# Altium project Overdrive.PrjPcb
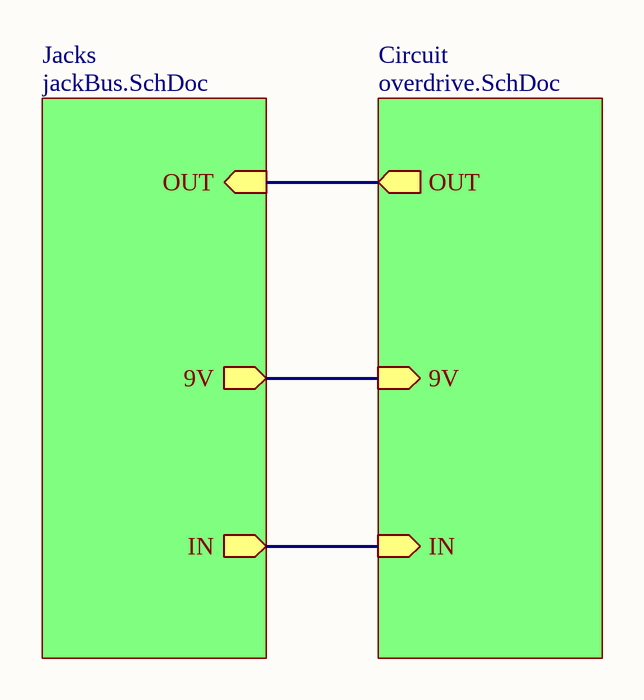
[diagram p0: pedal.SchDoc]
3 sheets, 22 parts. Net scope: hierarchical (ports join the sheet entries above them; power ports are global).
Board file: pedal.PcbDoc
Sheets:
  pedal.SchDoc
    Jacks = jackBus.SchDoc
    Circuit = overdrive.SchDoc

## Sheet pedal.SchDoc
size A4

### Sub-sheets
Circuit = overdrive.SchDoc: OUT (out), 9V (in), IN (in)
Jacks = jackBus.SchDoc: OUT (in), 9V (out), IN (out)

### Nets
NetCIN_1: sheet Jacks/IN, sheet Circuit/IN
NetJOUT_1: sheet Jacks/OUT, sheet Circuit/OUT
NetJSUP_1: sheet Jacks/9V, sheet Circuit/9V

## Sheet jackBus.SchDoc
size A4
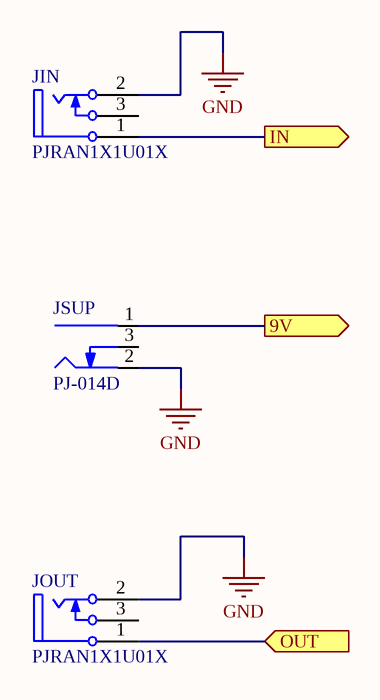
[diagram p1: jackBus.SchDoc]

### Parts
JIN  PJRAN1X1U01X  [SWIT-PJRAN1X1U01X_V]
JOUT  PJRAN1X1U01X  [SWIT-PJRAN1X1U01X_V]
JSUP  PJ-014D  [CUI PJ-014D]

### Ports
9V (out), IN (out), OUT (in)

### Nets
GND: JIN.2(TIP) JOUT.2(TIP) JSUP.2(Outer)
NetCIN_1: JIN.1(SLEEVE) ; port IN
NetJOUT_1: JOUT.1(SLEEVE) ; port OUT
NetJSUP_1: JSUP.1(Centre) ; port 9V

Not connected (* = marked no-connect by the designer): JIN 3(SHUNT); JOUT 3(SHUNT); JSUP 3(SW)

### Library data of the parts
JIN JOUT = CMP-1772-00003-1: Female Phono Jack, 3 Position, Height 13 mm, Tail Length 4 mm, RoHS, Bulk; Case\Package: Radial; Type (Capacitors): X7R; Tolerance: 10%; Voltage Rating (DC): 50 V; Capacitance: 100 nF; Package Quantity: 500; Mount: Through Hole; Packaging: Bulk; Height: 3.18 mm; Min Operating Temperature: -55 degC; Radiation Hardening: No; PackageDescription: Female Phono Jack, 3 Position, Height 13 mm, Tail Length 4 mm; Length: 6.6 mm; Lead Pitch: 2.54 mm; Width: 5.08 mm; REACH SVHC: No SVHC; ComponentLink1Description: Manufacturer URL; Max Operating Temperature: 125 degC; ComponentLink2Description: Datasheet; DatasheetVersion: Rev. A, 01/2006; Voltage Rating: 50 V; ComponentLink2URL: http://www.conxall.com/Drawings/pjran1x1u__x_series_cd.pdf; ComponentLink1URL: http://www.switchcraft.com/; RoHSCompliant: true; Pins: 2; PackageReference: PJRAN1X1U01X
JSUP = PJ-014D: CONN PWR JACK 1.3X3.4MM SOLDER; Manufacturer: CUI Devices; Actual Diameter: 0.051" (1.30mm ID), 0.165" (4.20mm OD); Current Rating (Amps): 2.5A; Gender: Male; Industry Recognized Mating Diameter: 1.30mm ID (0.051"), 3.40mm OD (0.134"); Internal Switch(s): Single Switch, Normally Closed; Material Flammability Rating: UL94 V-0; Mating Length/Depth: 0.283" (7.20mm); Number of Positions/Contacts: 2 Conductors, 3 Contacts; Shielding: Unshielded; Voltage - Rated: 24VDC; Part Number: PJ-014D; ComponentLink1Description: Datasheet; ComponentLink1URL: https://www.cuidevices.com/product/resource/digikeypdf/pj-014d.pdf; ComponentLink2Description: DigiKey Link; ComponentLink2URL: //digikey.com/product-detail/en/cui-devices/PJ-014D/CP-014D-ND/372124; Connector Type: Jack; Features: Board Guide; LastUpdated: 16/12/2019 18:55:00; Lifecycle Status: 0; Minimum Order: 1; Mounting Type: Through Hole, Right Angle; Packaging: Bulk; Part Status: Active; Price: 0.65; Series: -; Supplier 1: DigiKey; Supplier Part Number 1: CP-014D-ND; Termination: Solder

## Sheet overdrive.SchDoc
size A4
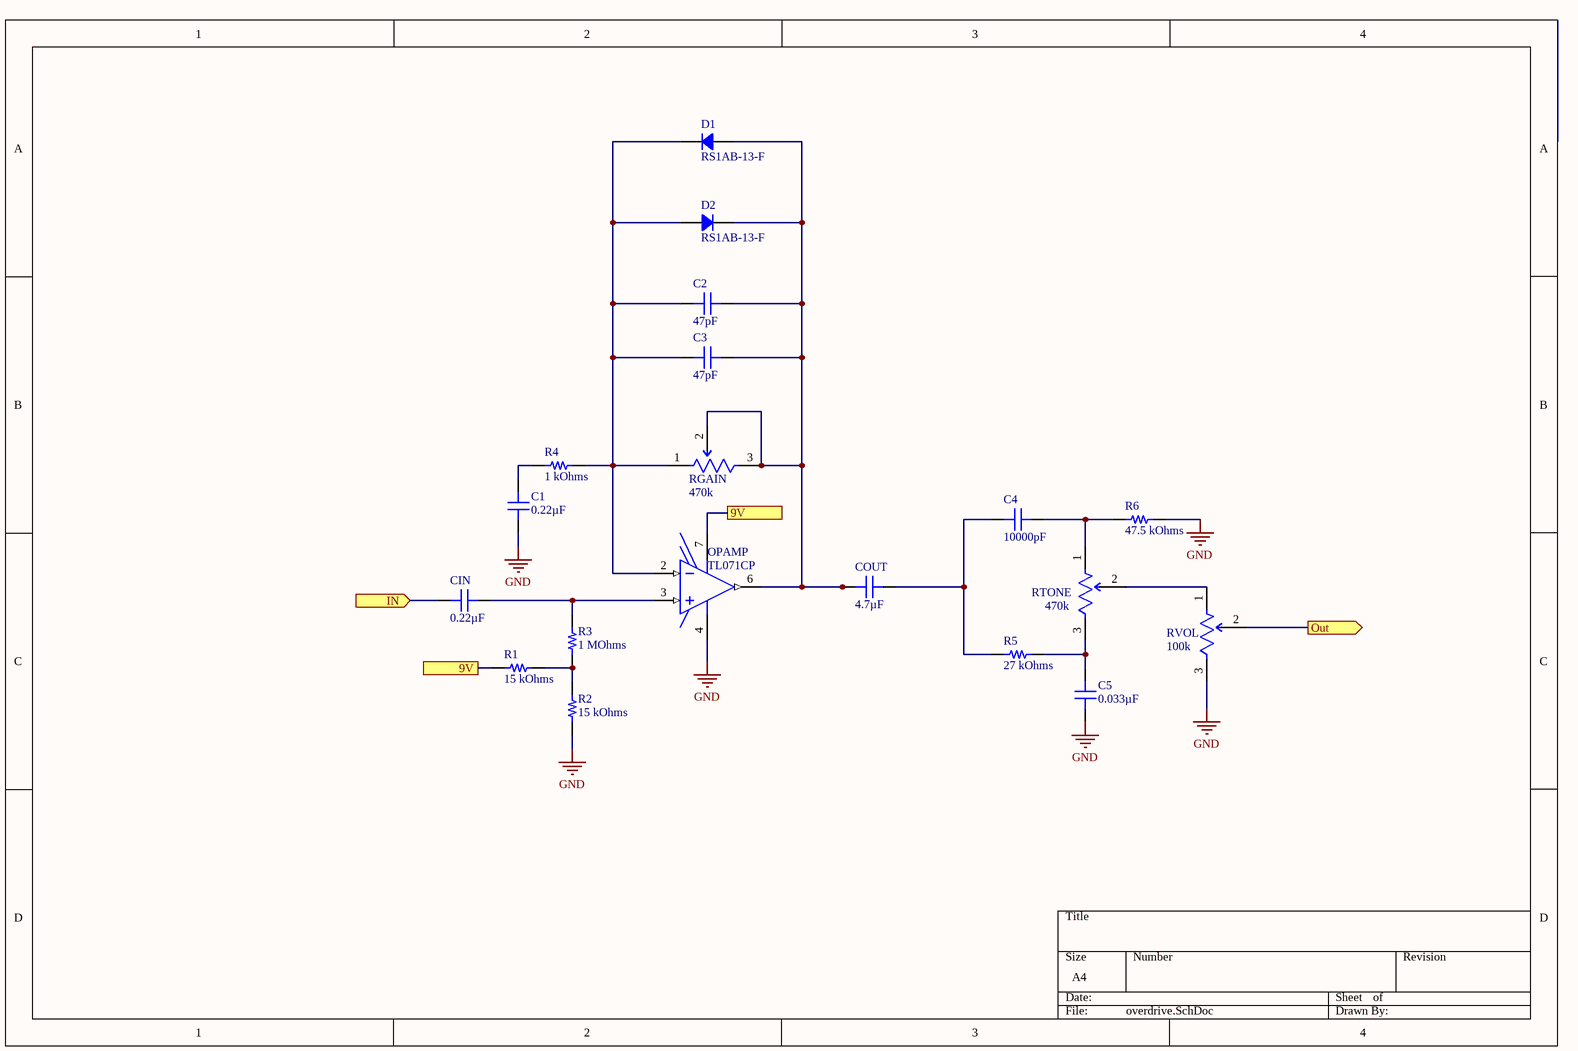
[diagram p2: overdrive.SchDoc]

### Parts
C1  0.22µF  [CAP 0402_1005]
C2  47pF  [CAP 01005_0402]
C3  47pF  [CAP 01005_0402]
C4  10000pF  [CAP 0402_1005]
C5  0.033µF  [CAP 0402_1005]
CIN  0.22µF  [CAP 0402_1005]
COUT  4.7µF  [CAP 0402_1005]
D1  RS1AB-13-F  [DO214AA SMB]
D2  RS1AB-13-F  [DO214AA SMB]
OPAMP  TL071CP  [P0008A]
R1  15 kOhms  [RES 0201_0603]
R2  15 kOhms  [RES 0201_0603]
R3  1 MOhms  [RES 0201_0603]
R4  1 kOhms  [RES 0201_0603]
R5  27 kOhms  [RES 0201_0603]
R6  47.5 kOhms  [RES 0201_0603]
RGAIN  470k  [FP-3310R-MFG]
RTONE  470k  [FP-3310R-MFG]
RVOL  100k  [FP-3310R-MFG]

### Ports
9V, IN (in), Out (out)

### Nets
GND: C1.2 C5.1 OPAMP.4(VCC-) R2.1 R6.2 RVOL.3(CW)
NetC1_1: C1.1 R4.1
NetC2_1: C2.1 C3.1 D1.2 D2.1 OPAMP.2(IN-) R4.2 RGAIN.1(CCW)
NetC2_2: C2.2 C3.2 COUT.1 D1.1 D2.2 OPAMP.6(OUT) RGAIN.2 RGAIN.3(CW)
NetC4_1: C4.1 R6.1 RTONE.1(CCW)
NetC4_2: C4.2 COUT.2 R5.1
NetC5_2: C5.2 R5.2 RTONE.3(CW)
NetCIN_1: CIN.1 ; port IN
NetCIN_2: CIN.2 OPAMP.3(IN+) R3.1
NetJOUT_1: RVOL.2 ; port Out
NetJSUP_1: OPAMP.7(VCC+) R1.1 ; port 9V
NetR1_2: R1.2 R2.2 R3.2
NetRTONE_2: RTONE.2 RVOL.1(CCW)

Not connected (* = marked no-connect by the designer): OPAMP 1(OFFSET_N1) 5(OFFSET_N2) 8(NC)

### Library data of the parts
C1 CIN = 0402BW224K160YT: CAP CER 0.22UF 16V X5R 0402; Manufacturer: Knowles Novacap; Tolerance: ±10%; Part Number: 0402BW224K160YT; Value: 0.22µF; Applications: General Purpose; Capacitance: 0.22µF; ComponentLink1Description: Datasheet; ComponentLink1URL: https://www.knowlescapacitors.com/getattachment/6c8d48ef-fc2b-4752-ae2c-ce6c208de0c4/High-Capacitance-Chip.aspx; ComponentLink2Description: DigiKey Link; ComponentLink2URL: http://digikey.com/product-detail/en/knowles-novacap/0402BW224K160YT/1763-1189-1-ND/7304304; Device Package: 0402 (1005 Metric); LastUpdated: 02/09/2020 01:02:25; Lifecycle Status: Active; Minimum Order: 1; Mounting Type: Surface Mount, MLCC; Operating Temperature: -55°C ~ 85°C; Package / Case: 0402 (1005 Metric); Packaging: TapeAndReel; PartId: 1712; Part Status: Active; Price: 0.47; Series: -; Size / Dimension: 0.040" L x 0.020" W (1.02mm x 0.51mm); Supplier 1: DigiKey; Supplier Part Number 1: 1763-1189-1-ND; Temperature Coefficient: X5R; Thickness (Max): 0.024" (0.61mm); Voltage - Rated: 16V
C2 C3 = GRM0225C1E470GA02L: CAP CER 47PF 25V C0G/NP0 01005; Manufacturer: Murata Electronics; Temperature Coefficient: C0G, NP0; Tolerance: ±2%; Part Number: GRM0225C1E470GA02L; Value: 47pF; Applications: General Purpose; Capacitance: 47pF; ComponentLink1Description: Datasheet; ComponentLink1URL: https://search.murata.co.jp/Ceramy/image/img/A01X/G101/ENG/GRM0225C1E470GA02-01.pdf; ComponentLink2Description: DigiKey Link; ComponentLink2URL: http://digikey.com/product-detail/en/murata-electronics/GRM0225C1E470GA02L/490-10133-1-ND/5026000; Device Package: 01005 (0402 Metric); LastUpdated: 02/09/2020 01:27:43; Lifecycle Status: Active; Minimum Order: 1; Mounting Type: Surface Mount, MLCC; Operating Temperature: -55°C ~ 125°C; Package / Case: 01005 (0402 Metric); Packaging: TapeAndReel; Part Status: Active; Price: 0.01; Series: GRM; Size / Dimension: 0.016" L x 0.008" W (0.40mm x 0.20mm); Supplier 1: DigiKey; Supplier Part Number 1: 490-10133-1-ND; Thickness (Max): 0.009" (0.22mm); Voltage - Rated: 25V
C4 = C0402C103K4RECAUTO: CAP CER 0402 10NF 16V X7R 10%; Manufacturer: KEMET; Part Number: C0402C103K4RECAUTO; Value: 10000pF; Applications: Automotive, ESD Protection; Capacitance: 10000pF; ComponentLink1Description: Datasheet; ComponentLink1URL: https://api.kemet.com/component-edge/download/datasheet/C0402C103K4RECAUTO.pdf; ComponentLink2Description: DigiKey Link; ComponentLink2URL: http://digikey.com/product-detail/en/kemet/C0402C103K4RECAUTO/399-17876-1-ND/8640543; Device Package: 0402 (1005 Metric); LastUpdated: 02/09/2020 01:02:25; Lifecycle Status: Active; Minimum Order: 1; Mounting Type: Surface Mount, MLCC; Operating Temperature: -55°C ~ 125°C; Package / Case: 0402 (1005 Metric); Packaging: TapeAndReel; PartId: 1725; Part Status: Active; Price: 0.02; Ratings: AEC-Q200; Series: ESD SMD Auto X7R; Size / Dimension: 0.039" L x 0.020" W (1.00mm x 0.50mm); Supplier 1: DigiKey; Supplier Part Number 1: 399-17876-1-ND; Temperature Coefficient: X7R; Thickness (Max): 0.022" (0.55mm); Tolerance: ±10%; Voltage - Rated: 16V
C5 = 0402B333K250CT: CAP CER 0.033UF 25V X7R 0402; Manufacturer: Walsin Technology Corporation; Tolerance: ±10%; Part Number: 0402B333K250CT; Value: 0.033µF; Applications: General Purpose; Capacitance: 0.033µF; ComponentLink1Description: Datasheet; ComponentLink1URL: http://www.passivecomponent.com/wp-content/uploads/2018/10/MLCC.pdf; ComponentLink2Description: DigiKey Link; ComponentLink2URL: http://digikey.com/product-detail/en/walsin-technology-corporation/0402B333K250CT/1292-1204-1-ND/9355208; Device Package: 0402 (1005 Metric); LastUpdated: 02/09/2020 01:02:24; Lifecycle Status: Active; Minimum Order: 1; Mounting Type: Surface Mount, MLCC; Operating Temperature: -55°C ~ 125°C; Package / Case: 0402 (1005 Metric); Packaging: TapeAndReel; PartId: 1968; Part Status: Active; Price: 0.01; Series: -; Size / Dimension: 0.039" L x 0.020" W (1.00mm x 0.50mm); Supplier 1: DigiKey; Supplier Part Number 1: 1292-1204-1-ND; Temperature Coefficient: X7R; Thickness (Max): 0.022" (0.55mm); Voltage - Rated: 25V
COUT = CL05A475MO5NUNC: CAP CER 4.7UF 16V X5R 0402; Manufacturer: Samsung Electro-Mechanics; Tolerance: ±20%; Part Number: CL05A475MO5NUNC; Value: 4.7µF; Applications: General Purpose; Capacitance: 4.7µF; ComponentLink1Description: Datasheet; ComponentLink1URL: http://www.samsungsem.com/kr/support/product-search/mlcc/__icsFiles/afieldfile/2019/05/29/Data%20sheet_CL05A475MO5NUNC.pdf; ComponentLink2Description: DigiKey Link; ComponentLink2URL: http://digikey.com/product-detail/en/samsung-electro-mechanics/CL05A475MO5NUNC/1276-6836-1-ND/5961695; Device Package: 0402 (1005 Metric); LastUpdated: 02/09/2020 01:02:25; Lifecycle Status: Active; Minimum Order: 1; Mounting Type: Surface Mount, MLCC; Operating Temperature: -55°C ~ 85°C; Package / Case: 0402 (1005 Metric); Packaging: TapeAndReel; PartId: 1760; Part Status: Active; Price: 0.10; Series: CL; Size / Dimension: 0.039" L x 0.020" W (1.00mm x 0.50mm); Supplier 1: DigiKey; Supplier Part Number 1: 1276-6836-1-ND; Temperature Coefficient: X5R; Thickness (Max): 0.022" (0.55mm); Voltage - Rated: 16V
D1 D2 = RS1AB-13-F: DIODE GEN PURP 50V 1A SMB; Manufacturer: Diodes Incorporated; Capacitance @ Vr, F: 15pF @ 4V, 1MHz; Current - Reverse Leakage @ Vr: 5µA @ 50V; Diode Type: Standard; Reverse Recovery Time (trr): 150ns; Speed: Fast Recovery =< 500ns, > 200mA (Io); Voltage - Forward (Vf) (Max) @ If: 1.3V @ 1A; Part Number: RS1AB-13-F; ComponentLink1Description: Datasheet; ComponentLink1URL: https://www.diodes.com/assets/Datasheets/ds15002.pdf; ComponentLink2Description: DigiKey Link; ComponentLink2URL: http://digikey.com/product-detail/en/diodes-incorporated/RS1AB-13-F/RS1AB-FDICT-ND/815907; Current - Average Rectified (Io): 1A; LastUpdated: 02/09/2020 01:18:53; Lifecycle Status: Active; Minimum Order: 1; Mounting Type: Surface Mount; Operating Temperature - Junction: -65°C ~ 150°C; Package / Case: DO-214AA, SMB; Packaging: TapeAndReel; PartId: 27; Part Status: Active; Price: 0.09; Series: -; Supplier 1: DigiKey; Supplier Part Number 1: RS1AB-FDICT-ND; Supplier Device Package: SMB; Voltage - DC Reverse (Vr) (Max): 50V
OPAMP = CMP-0017-00972-2: Low-Noise JFET-Input General-Purpose Operational Amplifier, 7 to 36 V, 0 to 70 degC, 8-pin DIP (P8), Pb-Free (RoHS); Manufacturer: Texas Instruments; Total Supply Voltage(Min)(+5V is 5, +/-5V is 10): 7; Iq per channel(Max)(mA): 2.5; GBW(Typ)(MHz): 3; Vio (25C)(Max)(mV): 10; CMRR(Min)(dB): 70; Rating: Military; Vn at 1kHz(Typ)(nV/rtHz): 18; IIB(Max)(pA): 200; Number of Channels: 1; Sub Family: General Purpose Amplifier, High Supply Voltage Amplifier (>=30V); Total Supply Voltage(Max)(+5V is 5, +/-5V is 10): 36; Slew Rate(Typ)(V/us): 13; ComponentLink1Description: Manufacturer URL; PackageReference: P0008A; ComponentLink3Description: Package Specification; ComponentLink3URL: http://www.ti.com/litv/pdf/mpdi001b; Mounting Technology: Through Hole; ComponentLink2Description: Datasheet; ComponentLink2URL: http://www.ti.com/lit/ds/symlink/tl071.pdf; PartNumber: TL071CP; Eco-Plan: Pb-Free (RoHS); Offset Drift(Typ)(uV/C): 18; Code_JEDEC: MS-001; DatasheetVersion: SLOS080J; PackageVersion: 4040082/E, 04/2010; PackageDescription: 8-Pin Plastic In-Line, Body 9.59 x 6.35 mm, Pitch 2.54 mm; ComponentLink1URL: http://www.ti.com/
R1 R2 = RK73B1HTTC153J: RES 15K OHM 5% 1/20W 0201; Manufacturer: KOA Speer Electronics, Inc.; Power (Watts): 0.05W, 1/20W; Temperature Coefficient: ±200ppm/°C; Part Number: RK73B1HTTC153J; Value: 15 kOhms; ComponentLink1Description: Datasheet; ComponentLink1URL: http://www.koaspeer.com/catimages/Products/RK73B/RK73B.pdf; ComponentLink2Description: DigiKey Link; ComponentLink2URL: http://digikey.com/product-detail/en/koa-speer-electronics-inc/RK73B1HTTC153J/2019-RK73B1HTTC153JCT-ND/9845771; Composition: Thick Film; Device Package: 0201 (0603 Metric); Features: Automotive AEC-Q200, Moisture Resistant; Height - Seated (Max): 0.010" (0.26mm); LastUpdated: 02/09/2020 01:06:23; Lifecycle Status: Active; Minimum Order: 1; Number of Terminations: 2; Operating Temperature: -55°C ~ 155°C; Package / Case: 0201 (0603 Metric); Packaging: CutTape; PartId: 735; Part Status: Active; Price: 0.10; Ratings: AEC-Q200; Resistance: 15 kOhms; Series: RK73B; Size / Dimension: 0.024" L x 0.012" W (0.60mm x 0.30mm); Supplier 1: DigiKey; Supplier Part Number 1: 2019-RK73B1HTTC153JCT-ND; Supplier Device Package: 0201; Tolerance: ±5%
R3 = RMCF0201JT1M00: RES 1M OHM 5% 1/20W 0201; Manufacturer: Stackpole Electronics Inc; Power (Watts): 0.05W, 1/20W; Temperature Coefficient: ±200ppm/°C; Part Number: RMCF0201JT1M00; Value: 1 MOhms; ComponentLink1Description: Datasheet; ComponentLink1URL: https://www.seielect.com/catalog/sei-rmcf_rmcp.pdf; ComponentLink2Description: DigiKey Link; ComponentLink2URL: http://digikey.com/product-detail/en/stackpole-electronics-inc/RMCF0201JT1M00/RMCF0201JT1M00CT-ND/3931515; Composition: Thick Film; Device Package: 0201 (0603 Metric); Height - Seated (Max): 0.010" (0.26mm); LastUpdated: 02/09/2020 01:06:21; Lifecycle Status: Active; Minimum Order: 1; Number of Terminations: 2; Operating Temperature: -55°C ~ 125°C; Package / Case: 0201 (0603 Metric); Packaging: CutTape; PartId: 992; Part Status: Active; Price: 0.10; Resistance: 1 MOhms; Series: RMCF; Size / Dimension: 0.024" L x 0.012" W (0.60mm x 0.30mm); Supplier 1: DigiKey; Supplier Part Number 1: RMCF0201JT1M00CT-ND; Supplier Device Package: 0201; Tolerance: ±5%
R4 = RMCF0201JT1K00: RES 1K OHM 5% 1/20W 0201; Manufacturer: Stackpole Electronics Inc; Power (Watts): 0.05W, 1/20W; Temperature Coefficient: ±200ppm/°C; Part Number: RMCF0201JT1K00; Value: 1 kOhms; ComponentLink1Description: Datasheet; ComponentLink1URL: https://www.seielect.com/catalog/sei-rmcf_rmcp.pdf; ComponentLink2Description: DigiKey Link; ComponentLink2URL: http://digikey.com/product-detail/en/stackpole-electronics-inc/RMCF0201JT1K00/RMCF0201JT1K00CT-ND/3931523; Composition: Thick Film; Device Package: 0201 (0603 Metric); Height - Seated (Max): 0.010" (0.26mm); LastUpdated: 02/09/2020 01:06:22; Lifecycle Status: Active; Minimum Order: 1; Number of Terminations: 2; Operating Temperature: -55°C ~ 125°C; Package / Case: 0201 (0603 Metric); Packaging: CutTape; PartId: 791; Part Status: Active; Price: 0.10; Resistance: 1 kOhms; Series: RMCF; Size / Dimension: 0.024" L x 0.012" W (0.60mm x 0.30mm); Supplier 1: DigiKey; Supplier Part Number 1: RMCF0201JT1K00CT-ND; Supplier Device Package: 0201; Tolerance: ±5%
R5 = RK73B1HTTC273J: RES 27K OHM 5% 1/20W 0201; Manufacturer: KOA Speer Electronics, Inc.; Power (Watts): 0.05W, 1/20W; Temperature Coefficient: ±200ppm/°C; Part Number: RK73B1HTTC273J; Value: 27 kOhms; ComponentLink1Description: Datasheet; ComponentLink1URL: http://www.koaspeer.com/catimages/Products/RK73B/RK73B.pdf; ComponentLink2Description: DigiKey Link; ComponentLink2URL: http://digikey.com/product-detail/en/koa-speer-electronics-inc/RK73B1HTTC273J/2019-RK73B1HTTC273JCT-ND/9845778; Composition: Thick Film; Device Package: 0201 (0603 Metric); Features: Automotive AEC-Q200, Moisture Resistant; Height - Seated (Max): 0.010" (0.26mm); LastUpdated: 02/09/2020 01:06:24; Lifecycle Status: Active; Minimum Order: 1; Number of Terminations: 2; Operating Temperature: -55°C ~ 155°C; Package / Case: 0201 (0603 Metric); Packaging: TapeAndReel; PartId: 411; Part Status: Active; Price: 0.01; Ratings: AEC-Q200; Resistance: 27 kOhms; Series: RK73B; Size / Dimension: 0.024" L x 0.012" W (0.60mm x 0.30mm); Supplier 1: DigiKey; Supplier Part Number 1: 2019-RK73B1HTTC273JCT-ND; Supplier Device Package: 0201; Tolerance: ±5%
R6 = RK73H1HTTC4752F: RES 47.5K OHM 1% 1/20W 0201; Manufacturer: KOA Speer Electronics, Inc.; Power (Watts): 0.05W, 1/20W; Temperature Coefficient: ±200ppm/°C; Part Number: RK73H1HTTC4752F; Value: 47.5 kOhms; ComponentLink1Description: Datasheet; ComponentLink1URL: http://www.koaspeer.com/catimages/Products/RK73H/RK73H.pdf; ComponentLink2Description: DigiKey Link; ComponentLink2URL: http://digikey.com/product-detail/en/koa-speer-electronics-inc/RK73H1HTTC4752F/2019-RK73H1HTTC4752FCT-ND/9845882; Composition: Thick Film; Device Package: 0201 (0603 Metric); Features: Automotive AEC-Q200, Moisture Resistant; Height - Seated (Max): 0.010" (0.26mm); LastUpdated: 02/09/2020 01:06:23; Lifecycle Status: Active; Minimum Order: 1; Number of Terminations: 2; Operating Temperature: -55°C ~ 155°C; Package / Case: 0201 (0603 Metric); Packaging: TapeAndReel; PartId: 607; Part Status: Active; Price: 0.01; Ratings: AEC-Q200; Resistance: 47.5 kOhms; Series: RK73H; Size / Dimension: 0.024" L x 0.012" W (0.60mm x 0.30mm); Supplier 1: DigiKey; Supplier Part Number 1: 2019-RK73H1HTTC4752FCT-ND; Supplier Device Package: 0201; Tolerance: ±1%
RGAIN RTONE = CMP-07234-000023-1: 470k -0k; Resistance: 10kR; Max Power Dissipation: 250mW; Temperature Coefficient: 1000ppm/°C; Actuator Length: 0.22inch; Tolerance: 20%; Actuator Diameter: 0.125inch; Number of Turns: 1; Type: Potentiometer; Taper: Linear; Max Operating Temperature: 125°C; Package Quantity: 50; Packaging: Bulk; Composition: Conductive Plastic; REACH SVHC: No SVHC; Contact Plating: Tin; Number of Gangs: 1; Weight: 4.5g; Mount: Through Hole; Min Operating Temperature: -40°C; Termination: Pin; Power Rating: 250mW
RVOL = CMP-07234-000023-1: 100k -0k; Resistance: 10kR; Max Power Dissipation: 250mW; Temperature Coefficient: 1000ppm/°C; Actuator Length: 0.22inch; Tolerance: 20%; Actuator Diameter: 0.125inch; Number of Turns: 1; Type: Potentiometer; Taper: Linear; Max Operating Temperature: 125°C; Package Quantity: 50; Packaging: Bulk; Composition: Conductive Plastic; REACH SVHC: No SVHC; Contact Plating: Tin; Number of Gangs: 1; Weight: 4.5g; Mount: Through Hole; Min Operating Temperature: -40°C; Termination: Pin; Power Rating: 250mW

## Nets that join several sheets
GND: jackBus (JIN.2 JOUT.2 JSUP.2), overdrive (6 pins)
NetCIN_1: jackBus (JIN.1), overdrive (CIN.1)
NetJOUT_1: jackBus (JOUT.1), overdrive (RVOL.2)
NetJSUP_1: jackBus (JSUP.1), overdrive (OPAMP.7 R1.1)